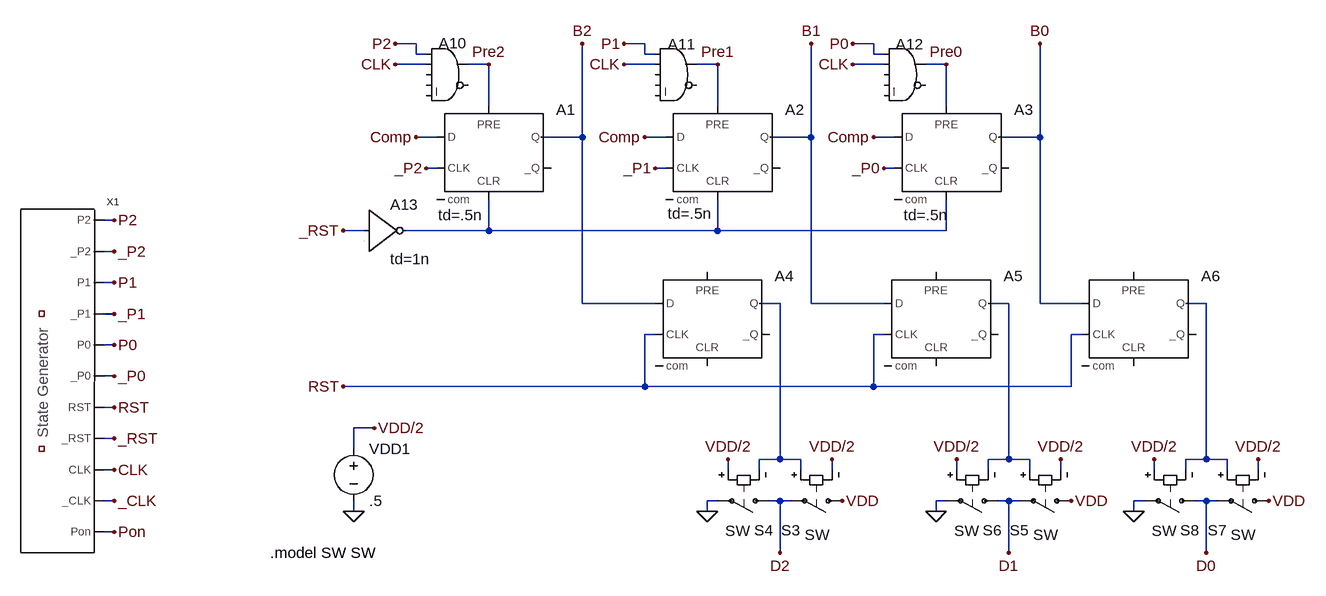
[diagram p0: schematic SuccessiveApproximationRegister.asc]
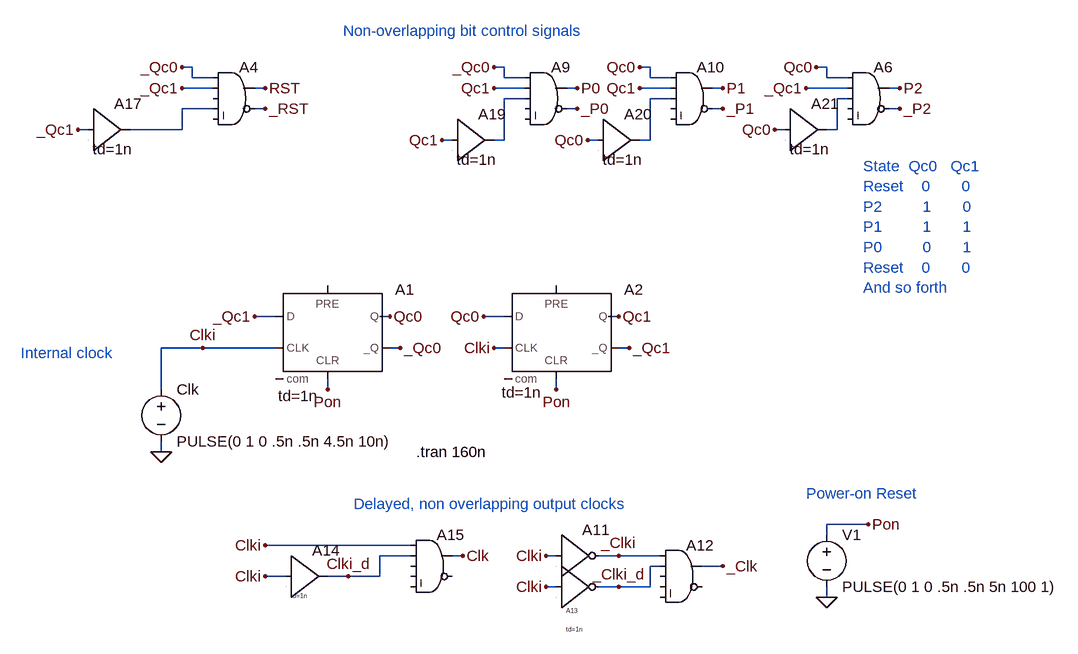
[diagram p1: sub-circuit stategen.asc]
SuccessiveApproximationRegister.asc, the LTspice schematic file:
Version 4
SHEET 1 1744 1132
WIRE 352 32 320 32
WIRE 704 32 672 32
WIRE 1056 32 1024 32
WIRE 352 48 352 32
WIRE 368 48 352 48
WIRE 704 48 704 32
WIRE 720 48 704 48
WIRE 1056 48 1056 32
WIRE 1072 48 1056 48
WIRE 368 64 320 64
WIRE 464 64 432 64
WIRE 720 64 672 64
WIRE 816 64 784 64
WIRE 1072 64 1024 64
WIRE 1168 64 1136 64
WIRE 464 128 464 64
WIRE 816 128 816 64
WIRE 1168 128 1168 64
WIRE 384 176 352 176
WIRE 608 176 608 32
WIRE 608 176 544 176
WIRE 736 176 704 176
WIRE 960 176 960 32
WIRE 960 176 896 176
WIRE 1088 176 1056 176
WIRE 1312 176 1312 32
WIRE 1312 176 1248 176
WIRE 384 224 368 224
WIRE 736 224 720 224
WIRE 1088 224 1072 224
WIRE -112 304 -128 304
WIRE 272 320 240 320
WIRE 464 320 464 272
WIRE 464 320 336 320
WIRE 816 320 816 272
WIRE 816 320 464 320
WIRE 1168 320 1168 272
WIRE 1168 320 816 320
WIRE -112 352 -128 352
WIRE -112 400 -128 400
WIRE 608 432 608 176
WIRE 720 432 608 432
WIRE 912 432 880 432
WIRE 960 432 960 176
WIRE 1072 432 960 432
WIRE 1264 432 1232 432
WIRE 1312 432 1312 176
WIRE 1376 432 1312 432
WIRE 1568 432 1536 432
WIRE -112 448 -128 448
WIRE 720 480 704 480
WIRE 1072 480 1056 480
WIRE 1376 480 1360 480
WIRE -112 496 -128 496
WIRE -112 544 -128 544
WIRE 704 560 704 480
WIRE 704 560 240 560
WIRE 1056 560 1056 480
WIRE 1056 560 704 560
WIRE 1360 560 1360 480
WIRE 1360 560 1056 560
WIRE -112 592 -128 592
WIRE 288 624 256 624
WIRE -112 640 -128 640
WIRE 256 656 256 624
WIRE 912 672 912 432
WIRE 912 672 880 672
WIRE 944 672 912 672
WIRE 1264 672 1264 432
WIRE 1264 672 1232 672
WIRE 1296 672 1264 672
WIRE 1568 672 1568 432
WIRE 1568 672 1536 672
WIRE 1600 672 1568 672
WIRE -112 688 -128 688
WIRE 832 688 832 672
WIRE 880 688 880 672
WIRE 944 688 944 672
WIRE 992 688 992 672
WIRE 1184 688 1184 672
WIRE 1232 688 1232 672
WIRE 1296 688 1296 672
WIRE 1344 688 1344 672
WIRE 1488 688 1488 672
WIRE 1536 688 1536 672
WIRE 1600 688 1600 672
WIRE 1648 688 1648 672
WIRE -112 736 -128 736
WIRE 816 736 800 736
WIRE 912 736 896 736
WIRE 928 736 912 736
WIRE 1168 736 1152 736
WIRE 1264 736 1248 736
WIRE 1280 736 1264 736
WIRE 1472 736 1456 736
WIRE 1568 736 1552 736
WIRE 1584 736 1568 736
WIRE 256 752 256 736
WIRE 800 752 800 736
WIRE 1152 752 1152 736
WIRE 1456 752 1456 736
WIRE -112 784 -128 784
WIRE 912 816 912 736
WIRE 1264 816 1264 736
WIRE 1568 816 1568 736
FLAG -112 304 P2
FLAG -112 400 P1
FLAG -112 496 P0
FLAG -112 352 _P2
FLAG -112 448 _P1
FLAG -112 544 _P0
FLAG -112 592 RST
FLAG -112 640 _RST
FLAG -112 688 CLK
FLAG -112 736 _CLK
FLAG -112 784 Pon
FLAG 1024 32 P0
FLAG 672 32 P1
FLAG 320 32 P2
FLAG 240 560 RST
FLAG 240 320 _RST
FLAG 352 176 Comp
FLAG 704 176 Comp
FLAG 1056 176 Comp
FLAG 320 64 CLK
FLAG 672 64 CLK
FLAG 1024 64 CLK
FLAG 1072 224 _P0
FLAG 720 224 _P1
FLAG 368 224 _P2
FLAG 1312 32 B0
FLAG 960 32 B1
FLAG 608 32 B2
FLAG 1568 816 D0
FLAG 1264 816 D1
FLAG 912 816 D2
FLAG 1168 64 Pre0
FLAG 816 64 Pre1
FLAG 464 64 Pre2
FLAG 800 752 0
FLAG 1008 736 VDD
FLAG 992 672 VDD/2
FLAG 832 672 VDD/2
FLAG 1152 752 0
FLAG 1360 736 VDD
FLAG 1344 672 VDD/2
FLAG 1184 672 VDD/2
FLAG 1456 752 0
FLAG 1664 736 VDD
FLAG 1648 672 VDD/2
FLAG 1488 672 VDD/2
FLAG 256 752 0
FLAG 288 624 VDD/2
SYMBOL Digital\\dflop 464 128 R0
WINDOW 3 -78 168 Left 2
SYMATTR Value td=.5n
SYMATTR InstName A1
SYMBOL Digital\\dflop 816 128 R0
WINDOW 3 -77 166 Left 2
SYMATTR Value td=.5n
SYMATTR InstName A2
SYMBOL Digital\\dflop 800 384 R0
SYMATTR InstName A4
SYMBOL Digital\\dflop 1152 384 R0
SYMATTR InstName A5
SYMBOL Digital\\dflop 1456 384 R0
SYMATTR InstName A6
SYMBOL StateGen -256 672 R0
SYMATTR InstName X1
SYMBOL Digital\\and 400 16 R0
WINDOW 0 -13 15 Left 2
SYMATTR InstName A10
SYMBOL Digital\\and 752 16 R0
WINDOW 0 -13 17 Left 2
SYMATTR InstName A11
SYMBOL Digital\\and 1104 16 R0
WINDOW 0 -14 17 Left 2
SYMATTR InstName A12
SYMBOL Digital\\inv 272 256 R0
SYMATTR InstName A13
SYMATTR Value td=1n
SYMBOL sw 1024 736 R90
WINDOW 0 45 81 VRight 2
WINDOW 3 52 36 VRight 2
SYMATTR InstName S3
SYMBOL sw 912 736 R90
WINDOW 0 45 40 VLeft 2
WINDOW 3 46 84 VLeft 2
SYMATTR InstName S4
SYMBOL sw 1376 736 R90
WINDOW 0 45 81 VRight 2
WINDOW 3 52 36 VRight 2
SYMATTR InstName S5
SYMBOL sw 1264 736 R90
WINDOW 0 45 40 VLeft 2
WINDOW 3 46 84 VLeft 2
SYMATTR InstName S6
SYMBOL sw 1680 736 R90
WINDOW 0 45 81 VRight 2
WINDOW 3 52 36 VRight 2
SYMATTR InstName S7
SYMBOL sw 1568 736 R90
WINDOW 0 45 40 VLeft 2
WINDOW 3 46 84 VLeft 2
SYMATTR InstName S8
SYMBOL voltage 256 640 R0
WINDOW 123 0 0 Left 0
WINDOW 39 0 0 Left 0
SYMATTR InstName VDD1
SYMATTR Value .5
SYMBOL Digital\\dflop 1168 128 R0
WINDOW 3 -66 168 Left 2
SYMATTR Value td=.5n
SYMATTR InstName A3
TEXT 128 816 Left 2 !.model SW SW

stategen.asc, the sub-circuit schematic file:
Version 4
SHEET 1 880 716
WIRE -768 -272 -784 -272
WIRE -288 -272 -304 -272
WIRE -64 -272 -80 -272
WIRE 208 -272 192 -272
WIRE -768 -256 -768 -272
WIRE -736 -256 -768 -256
WIRE -288 -256 -288 -272
WIRE -256 -256 -288 -256
WIRE -64 -256 -64 -272
WIRE -32 -256 -64 -256
WIRE 208 -256 208 -272
WIRE 240 -256 208 -256
WIRE -736 -240 -784 -240
WIRE -656 -240 -672 -240
WIRE -256 -240 -304 -240
WIRE -176 -240 -192 -240
WIRE -32 -240 -80 -240
WIRE 48 -240 32 -240
WIRE 240 -240 176 -240
WIRE 320 -240 304 -240
WIRE -256 -224 -288 -224
WIRE -32 -224 -64 -224
WIRE 240 -224 224 -224
WIRE -736 -208 -784 -208
WIRE -656 -208 -672 -208
WIRE -176 -208 -192 -208
WIRE 48 -208 32 -208
WIRE 320 -208 304 -208
WIRE -928 -176 -944 -176
WIRE -784 -176 -784 -208
WIRE -784 -176 -864 -176
WIRE 144 -176 128 -176
WIRE 224 -176 224 -224
WIRE 224 -176 208 -176
WIRE -368 -160 -384 -160
WIRE -288 -160 -288 -224
WIRE -288 -160 -304 -160
WIRE -144 -160 -160 -160
WIRE -64 -160 -64 -224
WIRE -64 -160 -80 -160
WIRE -640 112 -672 112
WIRE -464 112 -480 112
WIRE -288 112 -320 112
WIRE -112 112 -128 112
WIRE -752 160 -816 160
WIRE -640 160 -752 160
WIRE -448 160 -464 160
WIRE -288 160 -304 160
WIRE -96 160 -112 160
WIRE -816 224 -816 160
WIRE -560 224 -560 208
WIRE -208 224 -208 208
WIRE -816 320 -816 304
WIRE 272 432 208 432
WIRE 208 448 208 432
WIRE -432 464 -656 464
WIRE -432 480 -480 480
WIRE -352 480 -368 480
WIRE -208 480 -224 480
WIRE -112 480 -144 480
WIRE -48 480 -112 480
WIRE -48 496 -64 496
WIRE 48 496 16 496
WIRE -624 512 -656 512
WIRE -528 512 -560 512
WIRE -480 512 -480 480
WIRE -480 512 -528 512
WIRE -208 528 -224 528
WIRE -112 528 -144 528
WIRE -64 528 -64 496
WIRE -64 528 -112 528
WIRE 208 544 208 528
FLAG -816 320 0
FLAG -448 160 _Qc0
FLAG -96 160 _Qc1
FLAG -464 112 Qc0
FLAG -112 112 Qc1
FLAG -752 160 Clki
FLAG 272 432 Pon
FLAG 208 544 0
FLAG -560 224 Pon
FLAG -208 224 Pon
FLAG 320 -240 P2
FLAG 48 -240 P1
FLAG -176 -240 P0
FLAG -784 -272 _Qc0
FLAG -784 -240 _Qc1
FLAG -304 -272 _Qc0
FLAG -304 -240 Qc1
FLAG -80 -240 Qc1
FLAG -80 -272 Qc0
FLAG 48 496 _Clk
FLAG -352 480 Clk
FLAG -656 512 Clki
FLAG -224 480 Clki
FLAG -224 528 Clki
FLAG -656 464 Clki
FLAG 320 -208 _P2
FLAG 48 -208 _P1
FLAG -176 -208 _P0
FLAG -528 512 Clki_d
FLAG -112 480 _Clki
FLAG -304 160 Clki
FLAG 192 -272 Qc0
FLAG -656 -240 RST
FLAG -656 -208 _RST
FLAG -944 -176 _Qc1
FLAG -384 -160 Qc1
FLAG -160 -160 Qc0
FLAG 128 -176 Qc0
FLAG -112 528 _Clki_d
FLAG 176 -240 _Qc1
FLAG -320 112 Qc0
FLAG -672 112 _Qc1
SYMBOL Digital\\dflop -560 64 R0
WINDOW 3 -76 170 Left 2
SYMATTR Value td=1n
SYMATTR InstName A1
SYMBOL Digital\\dflop -208 64 R0
WINDOW 3 -84 165 Left 2
SYMATTR Value td=1n
SYMATTR InstName A2
SYMBOL voltage -816 208 R0
WINDOW 123 0 0 Left 0
WINDOW 39 0 0 Left 0
SYMATTR InstName Clk
SYMATTR Value PULSE(0 1 0 .5n .5n 4.5n 10n)
SYMBOL voltage 208 432 R0
WINDOW 123 0 0 Left 0
WINDOW 39 0 0 Left 0
SYMATTR InstName V1
SYMATTR Value PULSE(0 1 0 .5n .5n 5n 100 1)
SYMBOL Digital\\and -704 -288 R0
SYMATTR InstName A4
SYMBOL Digital\\and -224 -288 R0
SYMATTR InstName A9
SYMBOL Digital\\and 0 -288 R0
SYMATTR InstName A10
SYMBOL Digital\\inv -208 416 R0
SYMATTR InstName A11
SYMBOL Digital\\and -16 448 R0
SYMATTR InstName A12
SYMBOL Digital\\inv -208 464 R0
WINDOW 0 15 101 Left 0
WINDOW 3 15 129 Left 0
SYMATTR InstName A13
SYMATTR Value td=1n
SYMBOL Digital\\buf1 -624 448 R0
WINDOW 3 7 94 Left 0
SYMATTR Value td=1n
SYMATTR InstName A14
SYMBOL Digital\\and -400 432 R0
SYMATTR InstName A15
SYMBOL Digital\\and 272 -288 R0
SYMATTR InstName A6
SYMBOL Digital\\buf1 -928 -240 R0
WINDOW 3 7 94 Left 2
SYMATTR Value td=1n
SYMATTR InstName A17
SYMBOL Digital\\buf1 -368 -224 R0
WINDOW 3 7 94 Left 2
SYMATTR Value td=1n
SYMATTR InstName A19
SYMBOL Digital\\buf1 -144 -224 R0
WINDOW 3 7 94 Left 2
SYMATTR Value td=1n
SYMATTR InstName A20
SYMBOL Digital\\buf1 144 -240 R0
WINDOW 3 7 94 Left 2
SYMATTR Value td=1n
SYMATTR InstName A21
TEXT -424 320 Left 2 !.tran 160n
TEXT -520 400 Left 2 ;Delayed, non overlapping output clocks
TEXT -1032 168 Left 2 ;Internal clock
TEXT -536 -328 Left 2 ;Non-overlapping bit control signals
TEXT 176 384 Left 2 ;Power-on Reset
TEXT 264 -120 Left 2 ;State  Qc0   Qc1\nReset    0       0  \nP2         1       0      \nP1         1       1      \nP0         0       1     \nReset    0       0     \nAnd so forth

The netlist it stands for:
* SuccessiveApproximationRegister.asc
A1 Comp 0 _P2 Pre2 N001 0 B2 0 DFLOP td=.5n
A2 Comp 0 _P1 Pre1 N001 0 B1 0 DFLOP td=.5n
A4 B2 0 RST 0 0 0 N002 0 DFLOP
A5 B1 0 RST 0 0 0 N003 0 DFLOP
A6 B0 0 RST 0 0 0 N004 0 DFLOP
XX1 RST P0 P1 P2 NC_01 CLK _CLK _RST _P0 _P1 _P2 NC_02 Pon stategen
A10 P2 CLK 0 0 0 0 Pre2 0 AND
A11 P1 CLK 0 0 0 0 Pre1 0 AND
A12 P0 CLK 0 0 0 0 Pre0 0 AND
A13 _RST 0 0 0 0 N001 0 0 BUF td=1n
S3 VDD D2 N002 VDD/2 SW
S4 D2 0 VDD/2 N002 SW
S5 VDD D1 N003 VDD/2 SW
S6 D1 0 VDD/2 N003 SW
S7 VDD D0 N004 VDD/2 SW
S8 D0 0 VDD/2 N004 SW
VDD1 VDD/2 0 .5
A3 Comp 0 _P0 Pre0 N001 0 B0 0 DFLOP td=.5n

* block symbol definitions
.subckt stategen RST P0 P1 P2 P3 CLK _CLK _RST _P0 _P1 _P2 _P3 Pon
A1 _Qc1 0 Clki 0 Pon _Qc0 Qc0 0 DFLOP td=1n
A2 Qc0 0 Clki 0 Pon _Qc1 Qc1 0 DFLOP td=1n
V§Clk Clki 0 PULSE(0 1 0 .5n .5n 4.5n 10n)
V1 Pon 0 PULSE(0 1 0 .5n .5n 5n 100 1)
A4 _Qc0 _Qc1 0 N004 0 _RST RST 0 AND
A9 _Qc0 Qc1 N001 0 0 _P0 P0 0 AND
A10 Qc0 Qc1 N002 0 0 _P1 P1 0 AND
A11 Clki 0 0 0 0 _Clki 0 0 BUF
A12 _Clki _Clki_d 0 0 0 0 _Clk 0 AND
A13 Clki 0 0 0 0 _Clki_d 0 0 BUF td=1n
A14 Clki 0 0 0 0 0 Clki_d 0 BUF td=1n
A15 Clki Clki_d 0 0 0 0 Clk 0 AND
A6 Qc0 _Qc1 N003 0 0 _P2 P2 0 AND
A17 _Qc1 0 0 0 0 0 N004 0 BUF td=1n
A19 Qc1 0 0 0 0 0 N001 0 BUF td=1n
A20 Qc0 0 0 0 0 0 N002 0 BUF td=1n
A21 Qc0 0 0 0 0 0 N003 0 BUF td=1n
.tran 160n
* Delayed, non overlapping output clocks
* Internal clock
* Non-overlapping bit control signals
* Power-on Reset
* State  Qc0   Qc1
* Reset    0       0
* P2         1       0
* P1         1       1
* P0         0       1
* Reset    0       0
* And so forth
.ends stategen

.model SW SW
.backanno
.end